# EAGLE design GlowWorm (EAGLE 9.6.2)
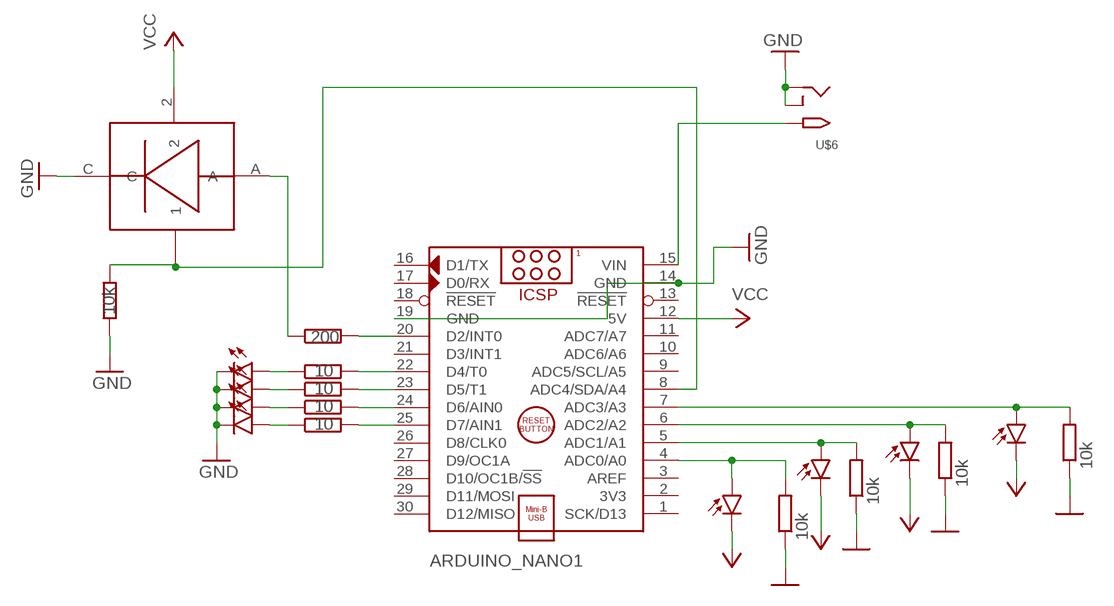
[diagram p0: schematic, sheet 1]

## Parts
ARDUINO_NANO1  ARDUINO_NANO  [ARDUINO_NANO]
R1  10  R-EU_0207/7  [0207/7]
R2  10k  R-EU_0207/7  [0207/7]
R5  10k  R-EU_0207/7  [0207/7]
R6  10k  R-EU_0207/7  [0207/7]
R7  10k  R-EU_0207/7  [0207/7]
R11  200  R-EU_0207/7  [0207/7]
R12  10  R-EU_0207/7  [0207/7]
R13  10  R-EU_0207/7  [0207/7]
R14  10  R-EU_0207/7  [0207/7]
R15  10k  R-EU_0207/7  [0207/7]
U$1  IR_RECEIVER  [LED_RECEIVER5MM_H6,0MM]
U$2  IR_RECEIVER  [LED_RECEIVER5MM_H6,0MM]
U$3  IR_RECEIVER  [LED_RECEIVER5MM_H6,0MM]
U$4  IR_RECEIVER  [LED_RECEIVER5MM_H6,0MM]
U$5  IR_TRANSMITTER  [LED5MM_H6,0MM]
U$6  2.1MMJACKTHM  [PJ-102A]
U$9  ARCADE_LED_BTN  [ARCADE_LED_BTN]
U$10  IR_TRANSMITTER  [LED5MM_H6,0MM]
U$11  IR_TRANSMITTER  [LED5MM_H6,0MM]
U$12  IR_TRANSMITTER  [LED5MM_H6,0MM]

## Nets
GND: ARDUINO_NANO1.14(GND) ARDUINO_NANO1.19(GND) R2.1 R5.1 R6.1 R7.1 R15.1 U$5.K(C) U$6.RING U$6.RING_SW U$9.C U$10.K(C) U$11.K(C) U$12.K(C)
N$1: ARDUINO_NANO1.4(ADC0/A0) R2.2 U$1.A(ANODE)
N$2: ARDUINO_NANO1.5(ADC1/A1) R6.2 U$3.A(ANODE)
N$3: ARDUINO_NANO1.6(ADC2/A2) R5.2 U$2.A(ANODE)
N$4: ARDUINO_NANO1.7(ADC3/A3) R7.2 U$4.A(ANODE)
N$5: ARDUINO_NANO1.20(D2/INT0) R11.2
N$6: ARDUINO_NANO1.22(D4/T0) R1.2
N$7: ARDUINO_NANO1.23(D5/T1) R12.2
N$8: ARDUINO_NANO1.24(D6/AIN0) R13.2
N$9: ARDUINO_NANO1.25(D7/AIN1) R14.2
N$10: R1.1 U$5.A
N$11: R12.1 U$10.A
N$12: R13.1 U$11.A
N$13: R14.1 U$12.A
N$14: R11.1 U$9.A
N$16: ARDUINO_NANO1.8(ADC4/SDA/A4) R15.2 U$9.1
N$18: ARDUINO_NANO1.15(VIN) U$6.TIP
VCC: ARDUINO_NANO1.12(5V) U$1.K(CATHODE) U$2.K(CATHODE) U$3.K(CATHODE) U$4.K(CATHODE) U$9.2
Unconnected: ARDUINO_NANO1.1(SCK/D13) ARDUINO_NANO1.2(3V3) ARDUINO_NANO1.3(AREF) ARDUINO_NANO1.9(ADC5/SCL/A5) ARDUINO_NANO1.10(ADC6/A6) ARDUINO_NANO1.11(ADC7/A7) ARDUINO_NANO1.13(!RESET) ARDUINO_NANO1.16(D1/TX) ARDUINO_NANO1.17(D0/RX) ARDUINO_NANO1.18(!RESET) ARDUINO_NANO1.21(D3/INT1) ARDUINO_NANO1.26(D8/CLK0) ARDUINO_NANO1.27(D9/OC1A) ARDUINO_NANO1.28(D10/OC1B/!SS) ARDUINO_NANO1.29(D11/MOSI) ARDUINO_NANO1.30(D12/MISO)

## Library data of the parts
ARDUINO_NANO1 = ArduinoNanoV30:ARDUINO_NANO: Arduino Nano V3.0 Module Overview: The Arduino Nano is a small, complete, and breadboard-friendly board based on the ATmega328 (Arduino Nano 3.x) or ATmega168 (Arduino Nano 2.x). It has more or less the same functionality of the Arduino Duemilanove, but in a different package. It lacks only a DC power jack, and works with a Mini-B USB cable instead of a standard one. The Nano was designed and is being produced by Gravitech <http://www.gravitech.us/arna30wiatp.html>. General specifications: Item Value Microcontroller Atmel ATmega168 or ATmega328 Operating Voltage (logic level) 5 V Input Voltage (recommended) 7-12 V Input Voltage (limits) 6-20 V Digital I/O Pins 14 (of which 6 provide PWM output) Analog Input Pins 8 DC Current per I/O Pin 40 mA Flash Memory 16 KB (ATmega168) or 32 KB (ATmega328) of which 2 KB used by bootloader SRAM 1 KB (ATmega168) or 2 KB (ATmega328) EEPROM 512 bytes (ATmega168) or 1 KB (ATmega328) Clock Speed 16 MHz Dimensions (Inches) 0.73" x 1.70" Dimensions (mm) 18mm x 45mm Overall height About 9 mm (not including pins) Weigth 5 g Power: The Arduino Nano can be powered via the Mini-B USB connection, 6-20V unregulated external power supply (pin 30), or 5V regulated external power supply (pin 27). The power source is automatically selected to the highest voltage source. Memory: The ATmega168 has 16 KB of flash memory for storing code (of which 2 KB is used for the bootloader); the ATmega328 has 32 KB, (also with 2 KB used for the bootloader). The ATmega168 has 1 KB of SRAM and 512 bytes of EEPROM (which can be read and written with the EEPROM library); the ATmega328 has 2 KB of SRAM and 1 KB of EEPROM. Input and Output: Each of the 14 digital pins on the Nano can be used as an input or output, using pinMode(), digitalWrite(), and digitalRead() functions. They operate at 5 volts. Each pin can provide or receive a maximum of 40 mA and has an internal pull-up resistor (disconnected by default) of 20-50 kOhms. In addition, some pins have specialized functions. Visit Arduino - ArduinoBoardNano <https://www.arduino.cc/en/Main/ArduinoBoardNano>
R1 R2 R5-R7 R11-R15 = rcl:R-EU_: RESISTOR, European symbol; SPICEPREFIX: R
U$1-U$4 = IR_Receiver:IR_RECEIVER
U$5 U$10-U$12 = IR_Receiver:IR_TRANSMITTER
U$6 = adafruit:2.1MMJACK: 2.1mm x 5.5mm THM DC jack with internal switch. Digikey part #PJ-102A, 4UCON part #05537 2.1mm x 5.5mm SMT DC jack with internal switch. Digikey part #PJ-002A-SMT, 4UCON part #03267 By microbuilder.eu & adafruit.com
U$9 = MomentaryPushBtns:ARCADE_LED_BTN

## Board
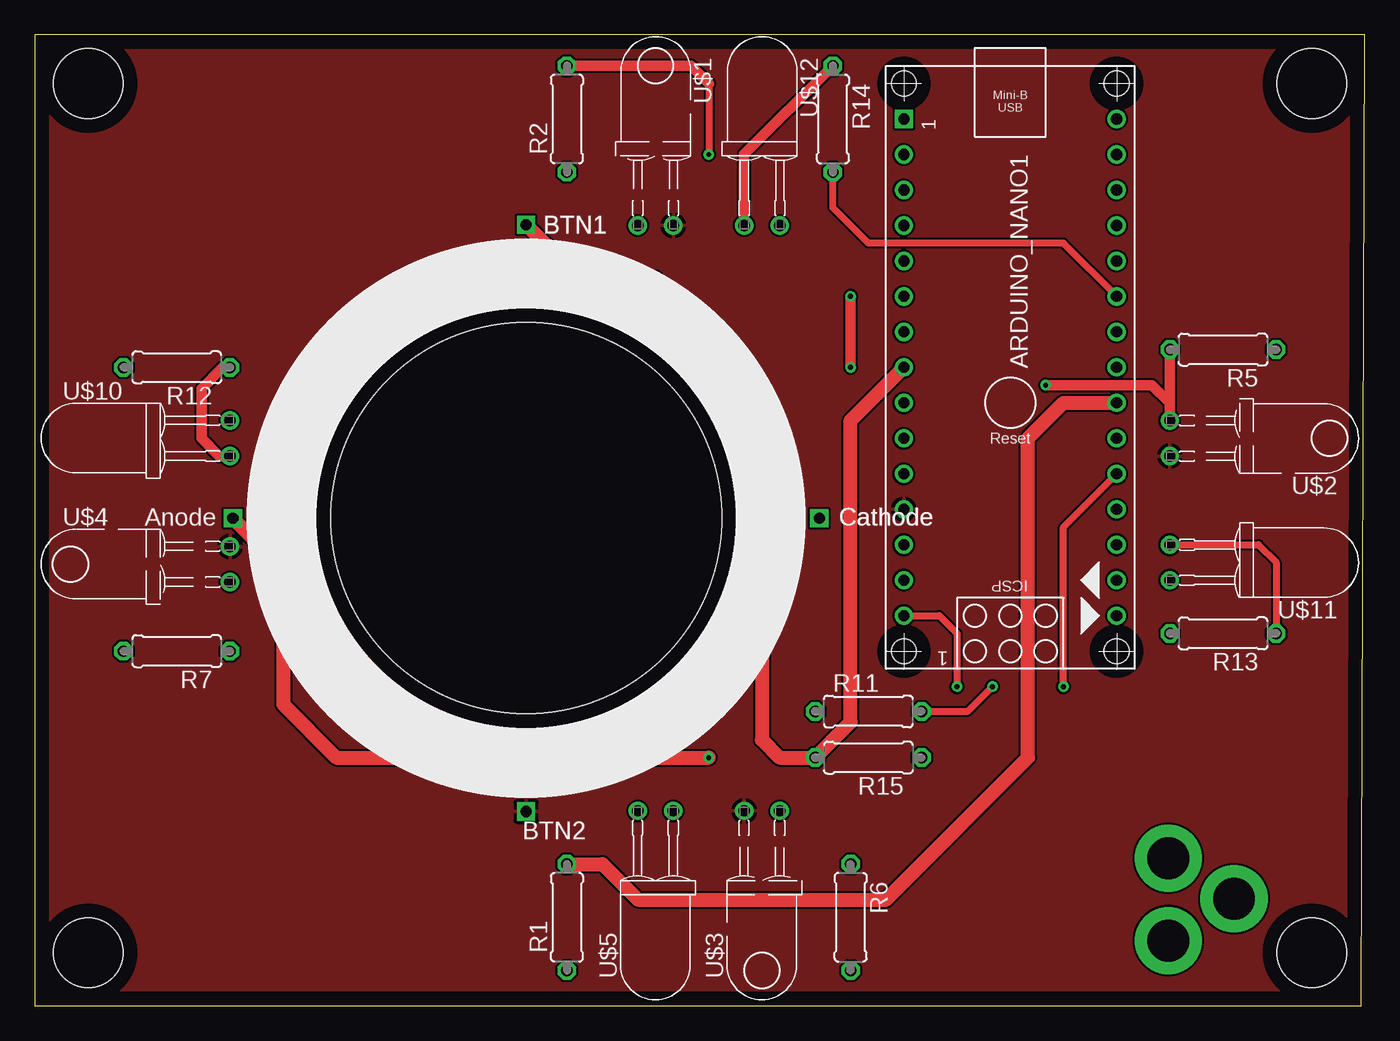
[diagram p1: board, top side]
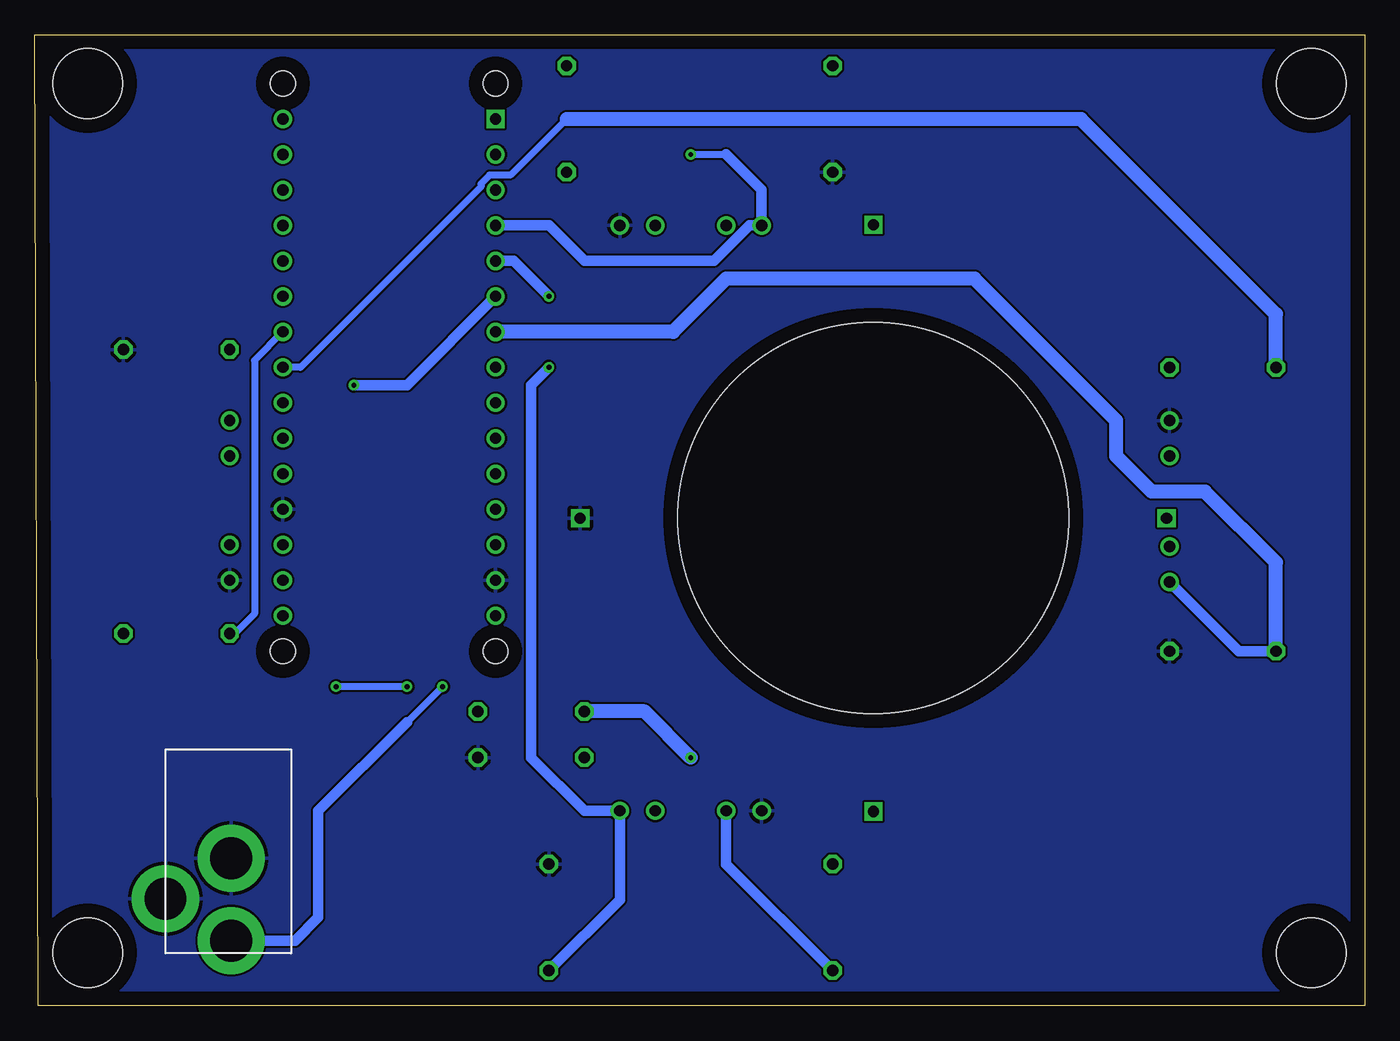
[diagram p2: board, bottom side, seen from below]

Size 95.23 x 69.52 mm. Coordinates in mm from the lower left corner, seen from the top.
Outline: 0,0 94.98,0 95.23,69.52 0,69.52 0,0
Copper layers (1*16): Top 0.035mm / dielectric 1.5mm / Bottom 0.035mm
Design rules "default *": minimum track width 6mil, minimum drill 0.35mm, track to track 6mil, track to pad 6mil, pad to pad 6mil, via to via 6mil, smd to smd 6mil, copper to edge 40mil, drill to drill 5mil, minimum pad ring 10mil, minimum via ring 8mil, stop-mask expansion 4mil, vias tented up to drill 0mil, thermal gap 10mil
Holes 5 mm at 91.44,3.81 3.81,3.81 3.81,66.04 91.44,66.04

### Footprints (pad centres in the part's own frame; a part is rotated, then mirrored left to right if it is on the bottom)
ARDUINO_NANO = drill 0.8 square: 1 -20.32,-7.62 | drill 0.8: 2 -17.78,-7.62; 3 -15.24,-7.62; 4 -12.7,-7.62; 5 -10.16,-7.62; 6 -7.62,-7.62; 7 -5.08,-7.62; 8 -2.54,-7.62; 9 0,-7.62; 10 2.54,-7.62; 11 5.08,-7.62; 12 7.62,-7.62; 13 10.16,-7.62; 14 12.7,-7.62; 15 15.24,-7.62; 16 15.24,7.62; 17 12.7,7.62; 18 10.16,7.62; 19 7.62,7.62; 20 5.08,7.62; 21 2.54,7.62; 22 0,7.62; 23 -2.54,7.62; 24 -5.08,7.62; 25 -7.62,7.62; 26 -10.16,7.62; 27 -12.7,7.62; 28 -15.24,7.62; 29 -17.78,7.62; 30 -20.32,7.62 | hole 1.778: -22.86,-7.62; -22.86,7.62; 17.78,7.62; 17.78,-7.62
0207/7 = drill 0.813 octagon: 1 -3.81,0; 2 3.81,0
LED_RECEIVER5MM_H6,0MM = drill 0.8 pad 1.27: A 0,-1.27; K 0,1.27
LED5MM_H6,0MM = drill 0.8 pad 1.27: A 0,-1.27; K 0,1.27
PJ-102A = drill 3 pad 4.8: RING 0.1,-3.39; RING_SW -4.6,-6.29; TIP 0.1,-9.29
ARCADE_LED_BTN = drill 0.8 square: 1 0,21; 2 0,-21; A -21,0; C 21,0 | hole 28: 0,0

### Placement (x,y rotation side)
ARDUINO_NANO1  69.85,43.18 270 top
R1  38.1,6.35 90 top
R2  38.1,63.5 90 top
R5  85.09,46.99 180 top
R6  58.42,6.35 270 top
R7  10.16,25.4 180 top
R11  59.69,21.08 0 top
R12  10.16,45.72 180 top
R13  85.09,26.67 180 top
R14  57.15,63.5 270 top
R15  59.69,17.78 180 top
U$1  44.45,55.88 270 top
U$2  81.28,40.64 180 top
U$3  52.07,13.97 90 top
U$4  13.97,31.62 0 top
U$5  44.45,13.97 90 top
U$6  81.28,13.97 0 bottom
U$9  35.18,34.92 0 top
U$10  13.97,40.64 0 top
U$11  81.28,31.75 180 top
U$12  52.07,55.88 270 top

### Tracks (layer width: path | path; a pad name or v marks a point on that pad's centre or on a via)
GND
  pour Bottom: -10.16,105.41 -10.16,-25.4 -6.35,-29.21 165.1,-29.21 173.99,-20.32 173.99,116.84 167.64,123.19 7.62,123.19
N$1  (via drill 0.35)
  Top 0.5: 48.26,66.04 v48.26,60.96
  Top 0.75: 48.26,66.04 46.99,67.31 R2.2
  Bottom 0.5: v48.26,60.96 45.72,60.96
  Bottom 0.75: ARDUINO_NANO1.4 58.42,55.88 55.88,53.34 46.59,53.34 44.05,55.88 U$1.A 43.18,58.42 45.72,60.96
N$2  (via drill 0.35)
  Top 0.75: v58.42,50.8 v58.42,45.72
  Bottom 0.75: ARDUINO_NANO1.5 60.96,53.34 v58.42,50.8 | v58.42,45.72 59.69,44.45 59.69,17.78 55.88,13.97 U$3.A 53.34,7.62 R6.2
N$3  (via drill 0.35)
  Top 0.75: v72.39,44.45 80.01,44.45 81.28,43.18 U$2.A R5.2
  Bottom 0.75: ARDUINO_NANO1.6 68.58,44.45 v72.39,44.45
N$4
  Bottom 0.75: R7.2 9.02,25.4 U$4.A
  Bottom 1: R7.2 6.35,31.75 11.43,36.83 15.24,36.83 17.78,39.37 17.78,41.91 27.94,52.07 45.72,52.07 49.53,48.26 ARDUINO_NANO1.7
N$5  (via drill 0.35)
  Top 0.5: R11.2 66.8,21.08 v68.58,22.86 | v73.66,22.86 73.66,34.29 ARDUINO_NANO1.20
  Bottom 0.5: v68.58,22.86 v73.66,22.86
N$6
  Top 1: R1.2 40.64,10.16 43.18,7.62 60.96,7.62 71.12,17.78 71.12,40.64 73.66,43.18 ARDUINO_NANO1.22
N$7
  Bottom 0.5: ARDUINO_NANO1.23 76.2,45.72 63.29,58.63 63.29,58.86 62.67,59.48 61.17,59.48 57.15,63.5
  Bottom 1: R12.2 6.35,49.53 20.32,63.5 57.15,63.5
N$8
  Bottom 0.5: ARDUINO_NANO1.24 79.5,46.23 79.5,28.07 80.9,26.67 R13.2
N$9
  Top 0.5: ARDUINO_NANO1.25 73.66,54.61 59.69,54.61 57.15,57.15 R14.2
N$10
  Bottom 0.75: R1.1 45.72,10.16 U$5.A
N$11
  Top 0.75: U$10.A 13.21,39.37 11.94,40.64 11.94,44.2 13.46,45.72 R12.1
N$12
  Top 0.5: R13.1 88.9,31.75 87.63,33.02 U$11.A
N$13
  Top 0.75: U$12.A 50.8,60.96 R14.1
N$14  (via drill 0.35)
  Top 1: U$9.A 17.78,31.32 17.78,21.59 21.59,17.78 v48.26,17.78
  Bottom 1: v48.26,17.78 51.56,21.08 R11.1
N$16
  Top 1: U$9.1 39.03,52.07 44.45,52.07 52.07,44.45 52.07,19.05 53.34,17.78 R15.2 58.42,20.32 58.42,41.91 ARDUINO_NANO1.8
N$18  (via drill 0.35)
  Top 0.5: ARDUINO_NANO1.15 64.77,27.94 66.04,26.67 v66.04,22.86
  Bottom 0.5: v66.04,22.86 68.58,20.32
  Bottom 0.75: 68.58,20.32 74.93,13.97 74.93,6.35 76.6,4.68 U$6.TIP
VCC
  pour Top: -12.7,111.76 -12.7,-13.97 -10.16,-16.51 165.1,-16.51 166.37,-15.24 184.15,2.54 184.15,120.65 -3.81,120.65 -5.08,121.92 -12.7,114.3